# EAGLE design Sensor-VEML6070 (EAGLE 7.7.0)
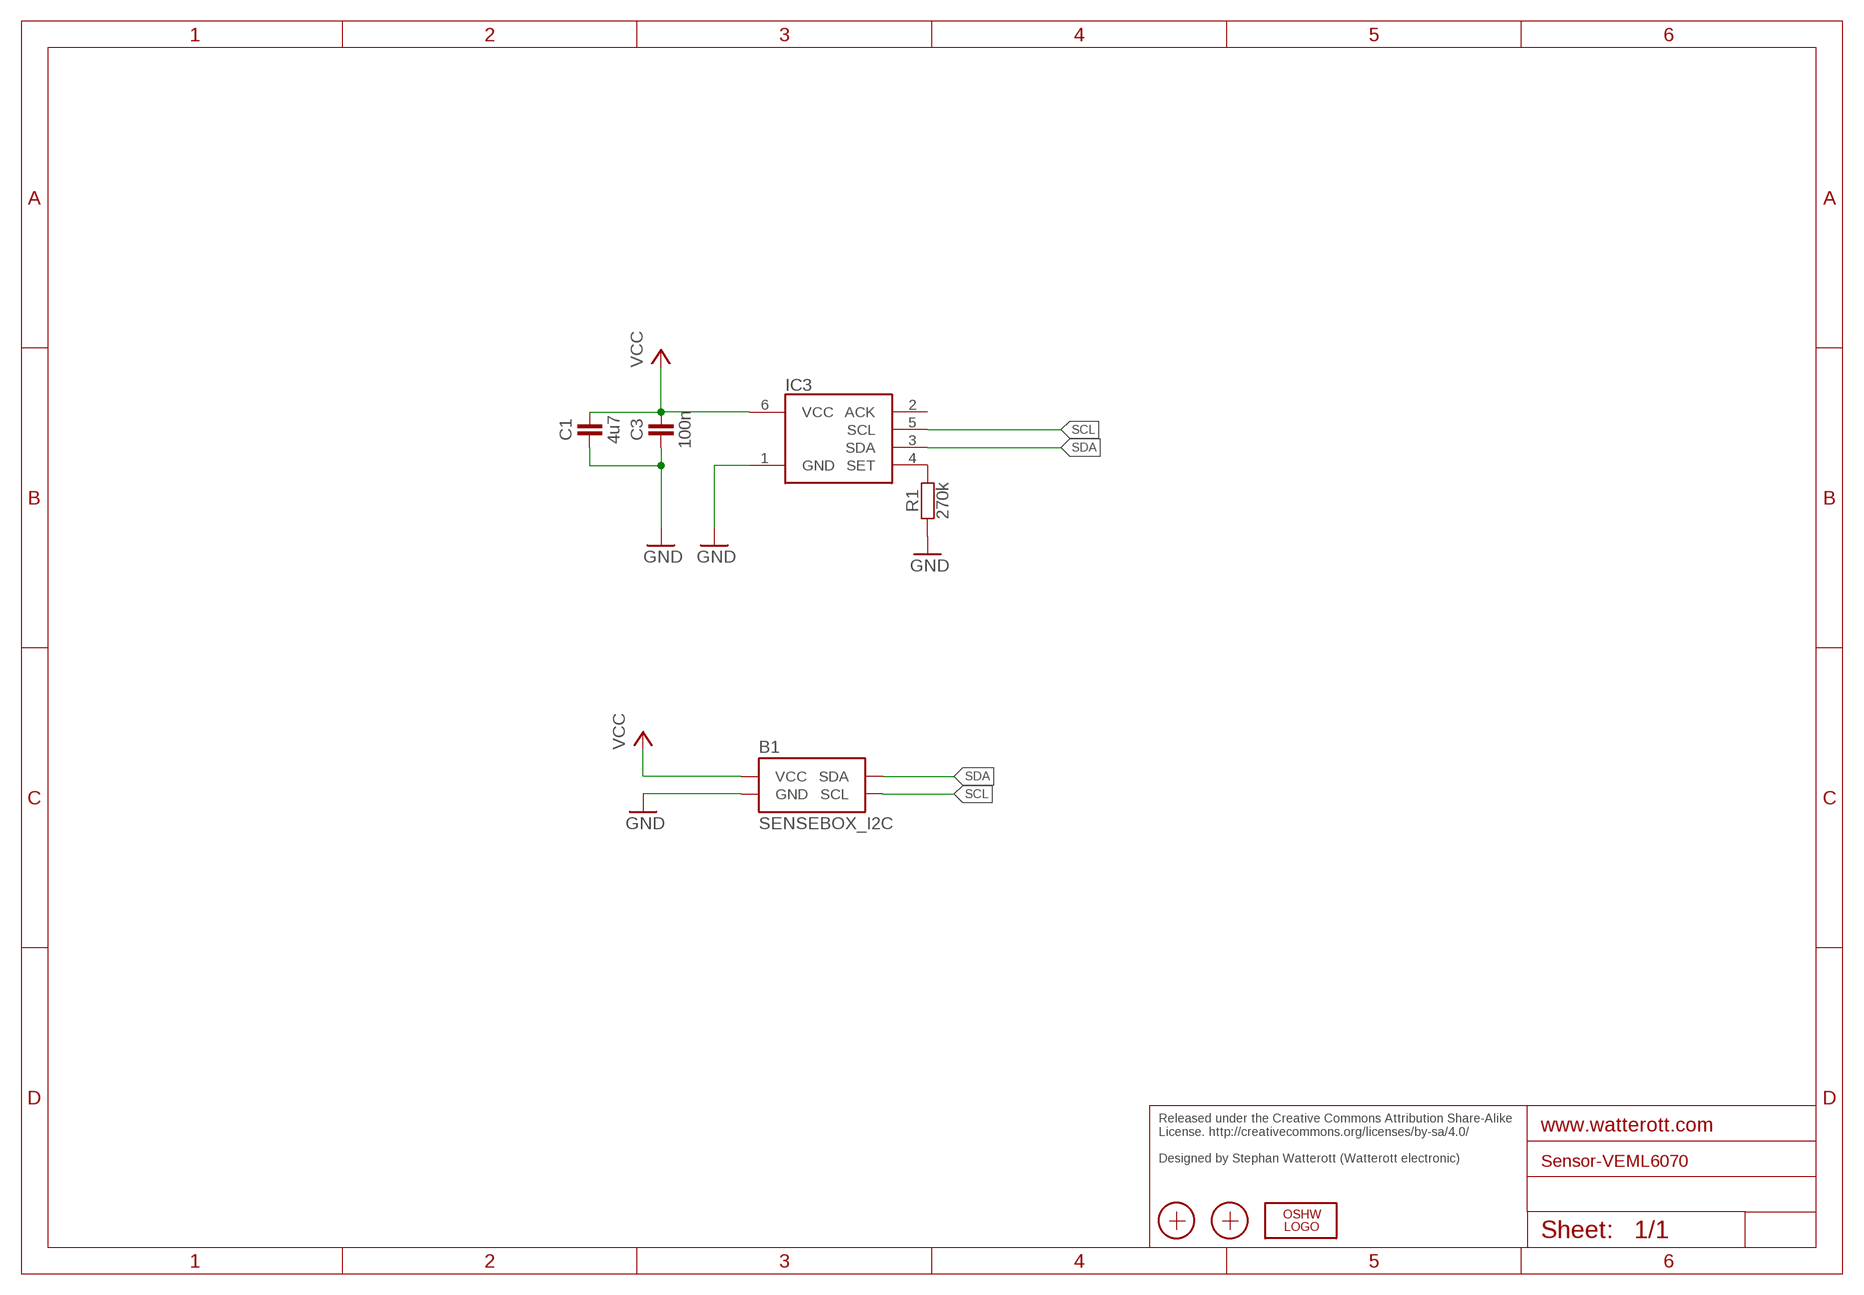
[diagram p0: schematic, sheet 1]

## Parts
B1  SENSEBOX_I2C  [BREAKOUT_SENSEBOX_I2C]
C1  4u7  CAPACITOR-C0402  [R0402]
C3  100n  CAPACITOR-C0402  [R0402]
IC3  VEML6070  [OPLGA]
LOGO2  OSHW_LOGOX0070  [OSHW_6X70]
R1  270k  RESISTOR-R0402  [R0402]
X1  PASSER-07  [PASSER_07MM]
X2  PASSER-07  [PASSER_07MM]

## Nets
GND: B1.GND C1.1 C3.1 IC3.1(GND) R1.1
N$1: IC3.4(SET) R1.2
SCL: B1.SCL IC3.5(SCL)
SDA: B1.SDA IC3.3(SDA)
VCC: B1.VCC C1.2 C3.2 IC3.6(VCC)
Unconnected: IC3.2(ACK)

## Notes on the sheet
- Released under the Creative Commons Attribution Share-Alike 
  License. http://creativecommons.org/licenses/by-sa/4.0/
  
  Designed by Stephan Watterott (Watterott electronic)

## Library data of the parts
B1 = we-board:SENSEBOX_I2C
C1 C3 = we-rcl:CAPACITOR: Capacitors ...4.7uF @ 6.3V -> 0402 ...10uF @ 16V -> 0603 ...22uF @ 25V -> 0805
IC3 = we-sensor:VEML6070: UV Light Sensor with I2C Interface - VEML6070 is an advanced ultraviolet (UV) light sensor with I2C protocol interface and designed by the CMOS process.
LOGO2 = we-symbol:OSHW_LOGO
R1 = we-rcl:RESISTOR: Resistors all kinds in 0603 and 0402
X1 X2 = we-symbol:PASSER

## Board
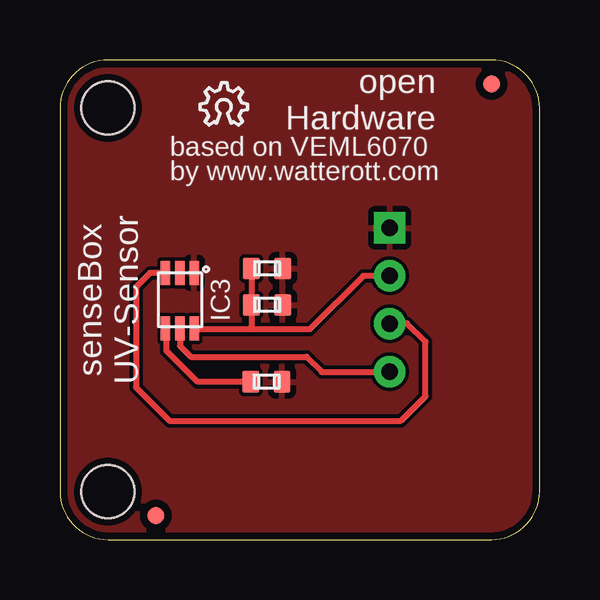
[diagram p1: board, top side]
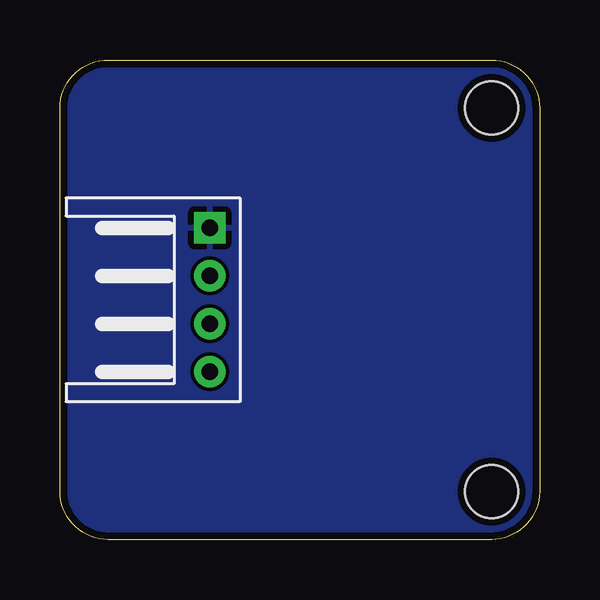
[diagram p2: board, bottom side, seen from below]

Size 20 x 20 mm. Coordinates in mm from the lower left corner, seen from the top.
Copper layers (1*16): Top 0.035mm / dielectric 1.5mm / Bottom 0.035mm
Design rules "we-dru-2-layer *": minimum track width 0.15mm, minimum drill 0.3mm, track to track 0.15mm, track to pad 0.15mm, pad to pad 0.15mm, via to via 0.15mm, smd to smd 0.1mm, copper to edge 0.3mm, drill to drill 0.2mm, minimum pad ring 0.18mm, minimum via ring 0.2mm, stop-mask expansion 0.1mm, vias tented up to drill 0.5mm, thermal gap 0.25mm

### Footprints (pad centres in the part's own frame; a part is rotated, then mirrored left to right if it is on the bottom)
BREAKOUT_SENSEBOX_I2C = drill 0.7 pad 1.3 square: GND 13.75,13 | drill 0.7 pad 1.3: SCL 13.75,7; SDA 13.75,9; VCC 13.75,11 | hole 2.2: 2,18; 2,2
R0402 = smd 0.9 x 0.7: 1 0,0.65; 2 0,-0.65
OPLGA = smd 1 x 0.4: 1 -1.12,0.6; 2 -1.12,0; 3 -1.12,-0.6; 4 1.2,-0.6; 5 1.2,0; 6 1.2,0.6
PASSER_07MM = smd 0.7 x 0.7: X 0,0

### Placement (x,y rotation side)
B1  0,0 0 top
C1  8.64,9.78 270 top
C3  8.64,11.3 270 top
IC3  5,10 270 top
LOGO2  5.84,17.27 0 top
R1  8.61,6.58 270 top
X1  18,19 0 top
X2  4,1 0 top

### Tracks (layer width: path | path; a pad name or v marks a point on that pad's centre or on a via)
GND
  pour Top: 0,20 20,20 20,0 0,0
  pour Bottom: 0,20 20,20 20,0 0,0
N$1
  Top 0.254: R1.2 5.74,6.58 4.45,7.87 4.45,8.76 IC3.4
SCL
  Top 0.254: IC3.5 5,8.08 5.46,7.62 10.29,7.62 10.92,6.99 13.73,6.99 B1.SCL
SDA
  Top 0.254: IC3.3 3.75,11.12 3.17,10.54 3.17,6.35 4.57,4.95 14.22,4.95 15.24,5.97 15.24,8.26 14.48,9.02 13.77,9.02 B1.SDA
VCC
  Top 0.254: B1.VCC 12.65,11 10.41,8.76 7.87,8.76 | 7.87,8.76 5.64,8.76 IC3.6 | C3.2 C1.2 7.99,8.88 7.87,8.76

### Text on the board
tPlace: open / Hardware | based on VEML6070 | by www.watterott.com | senseBox / UV-Sensor